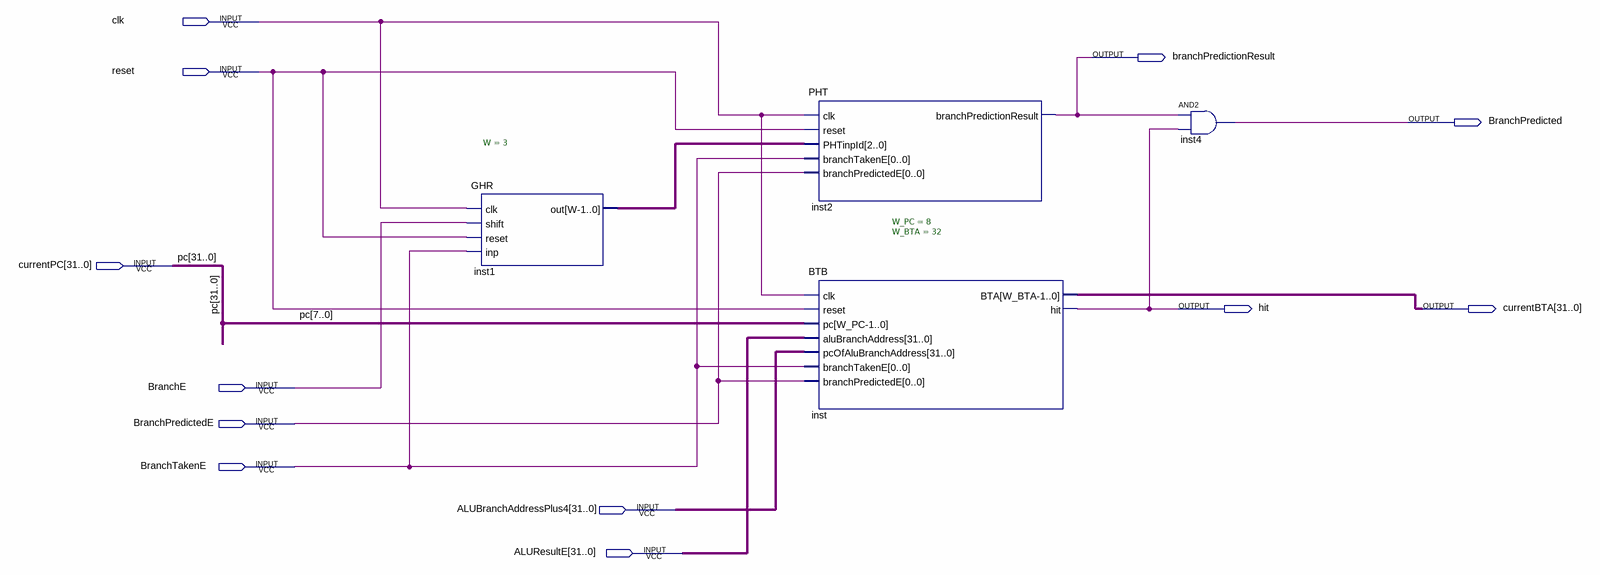
[diagram p0: schematic sheet]
// Quartus schematic branch_predictor_unit.bdf as structural Verilog: 4 symbols, 12 pins
module branch_predictor_unit (
  input  clk,
  input  reset,
  input  [31:0] currentPC,
  input  BranchE,
  input  BranchPredictedE,
  input  BranchTakenE,
  input  [31:0] ALUBranchAddressPlus4,
  input  [31:0] ALUResultE,
  output branchPredictionResult,
  output BranchPredicted,
  output hit,
  output [31:0] currentBTA
);

  wire [2:0] inst1_out;

  GHR #(.W(3)) inst1 (.clk(clk), .shift(BranchE), .reset(reset), .inp(BranchTakenE), .out(inst1_out));
  PHT inst2 (
    .clk(clk), .reset(reset), .PHTinpId(inst1_out), .branchTakenE(BranchTakenE),
    .branchPredictedE(BranchPredictedE), .branchPredictionResult(branchPredictionResult));
  BTB #(.W_PC(8), .W_BTA(32)) inst (
    .clk(clk), .reset(reset), .pc(currentPC[7:0]), .aluBranchAddress(ALUResultE),
    .pcOfAluBranchAddress(ALUBranchAddressPlus4), .branchTakenE(BranchTakenE),
    .branchPredictedE(BranchPredictedE), .BTA(currentBTA), .hit(hit));
  and inst4 (BranchPredicted, branchPredictionResult, hit);

  // Other names for the same wires on the sheet: pc[31:0] = currentPC
endmodule
